# EAGLE design SPosition (EAGLE 9.3.0)
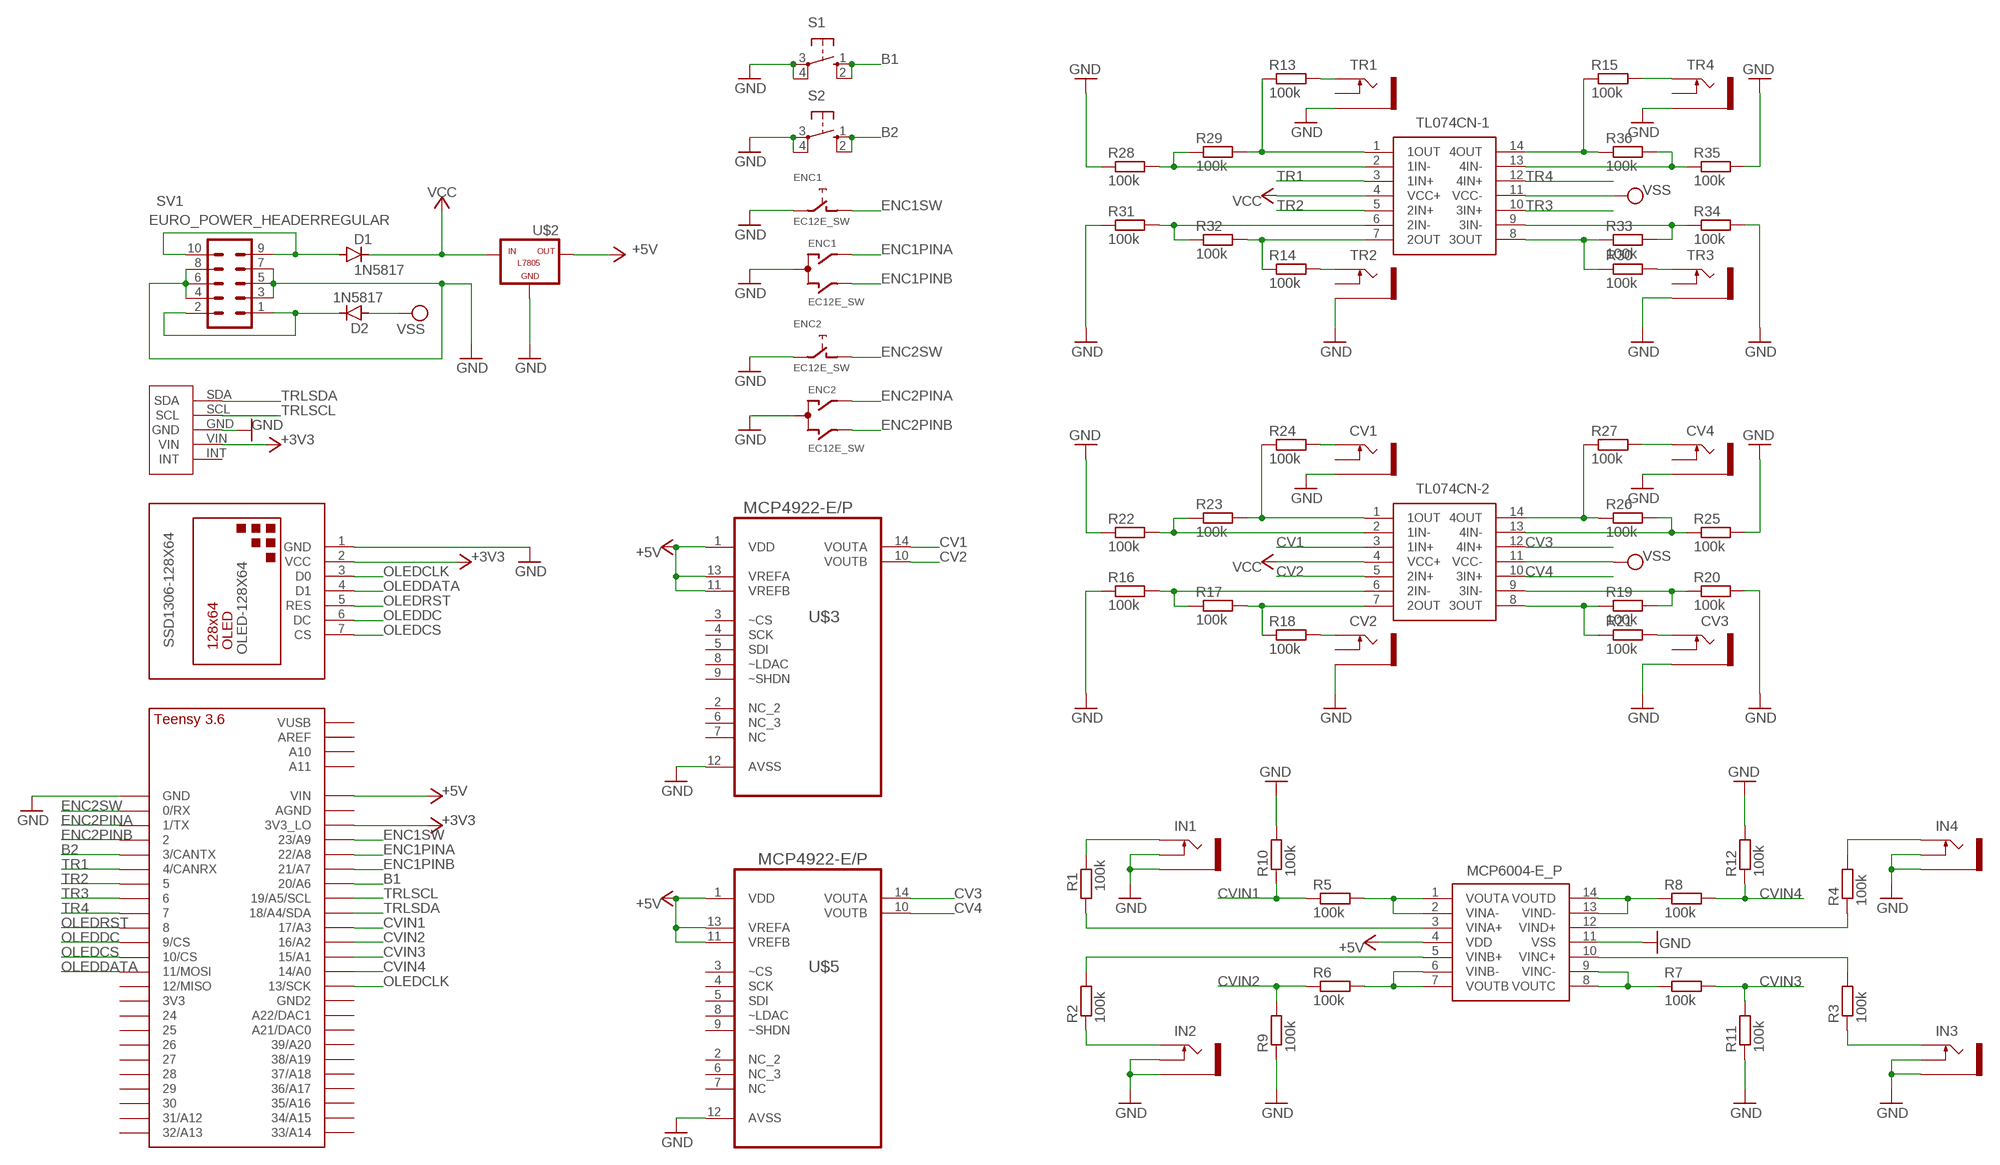
[diagram p0: schematic, sheet 1]

## Parts
CV1  THONKICONNNEW  [WQP-PJ301M-12_JACK]
CV2  THONKICONNNEW  [WQP-PJ301M-12_JACK]
CV3  THONKICONNNEW  [WQP-PJ301M-12_JACK]
CV4  THONKICONNNEW  [WQP-PJ301M-12_JACK]
D1  1N5817  1N4004  [DO41-10]
D2  1N5817  1N4004  [DO41-10]
ENC1  EC12E_SW  [ALPS_EC12E_SW]
ENC2  EC12E_SW  [ALPS_EC12E_SW]
IN1  THONKICONNNEW  [WQP-PJ301M-12_JACK]
IN2  THONKICONNNEW  [WQP-PJ301M-12_JACK]
IN3  THONKICONNNEW  [WQP-PJ301M-12_JACK]
IN4  THONKICONNNEW  [WQP-PJ301M-12_JACK]
MCP6004-E_P  MCP6004-E_P  [DIP781W56P254L1918H533Q14N]
R1  100k  R-EU_R0805  [R0805]
R2  100k  R-EU_R0805  [R0805]
R3  100k  R-EU_R0805  [R0805]
R4  100k  R-EU_R0805  [R0805]
R5  100k  R-EU_R0805  [R0805]
R6  100k  R-EU_R0805  [R0805]
R7  100k  R-EU_R0805  [R0805]
R8  100k  R-EU_R0805  [R0805]
R9  100k  R-EU_R0805  [R0805]
R10  100k  R-EU_R0805  [R0805]
R11  100k  R-EU_R0805  [R0805]
R12  100k  R-EU_R0805  [R0805]
R13  100k  R-EU_R0805  [R0805]
R14  100k  R-EU_R0805  [R0805]
R15  100k  R-EU_R0805  [R0805]
R16  100k  R-EU_R0805  [R0805]
R17  100k  R-EU_R0805  [R0805]
R18  100k  R-EU_R0805  [R0805]
R19  100k  R-EU_R0805  [R0805]
R20  100k  R-EU_R0805  [R0805]
R21  100k  R-EU_R0805  [R0805]
R22  100k  R-EU_R0805  [R0805]
R23  100k  R-EU_R0805  [R0805]
R24  100k  R-EU_R0805  [R0805]
R25  100k  R-EU_R0805  [R0805]
R26  100k  R-EU_R0805  [R0805]
R27  100k  R-EU_R0805  [R0805]
R28  100k  R-EU_R0805  [R0805]
R29  100k  R-EU_R0805  [R0805]
R30  100k  R-EU_R0805  [R0805]
R31  100k  R-EU_R0805  [R0805]
R32  100k  R-EU_R0805  [R0805]
R33  100k  R-EU_R0805  [R0805]
R34  100k  R-EU_R0805  [R0805]
R35  100k  R-EU_R0805  [R0805]
R36  100k  R-EU_R0805  [R0805]
S1  10-XX  [B3F-10XX]
S2  10-XX  [B3F-10XX]
SSD1306-128X64  OLED-128X64  [DISPLAY-OLED-128X64-SMALL]
SV1  EURO_POWER_HEADERREGULAR  [EURO_POWER_HEADER]
TL074CN-1  TL074CN  [DIP794W53P254L1930H508Q14N]
TL074CN-2  TL074CN  [DIP794W53P254L1930H508Q14N]
TR1  THONKICONNNEW  [WQP-PJ301M-12_JACK]
TR2  THONKICONNNEW  [WQP-PJ301M-12_JACK]
TR3  THONKICONNNEW  [WQP-PJ301M-12_JACK]
TR4  THONKICONNNEW  [WQP-PJ301M-12_JACK]
U$1  TEENSY_3.5/3.6_BASIC  [TEENSY_3.5/3.6_BASIC]
U$2  -L7805  [L7805]
U$3  MCP4922-E/P  [DIP254P762X533-14]
U$4  SUPERPOSITION  [SUPERPOSITION]
U$5  MCP4922-E/P  [DIP254P762X533-14]

## Nets
+3V3: SSD1306-128X64.2(VCC) U$1.3V3_LO U$4.VIN
+5V: MCP6004-E_P.4(VDD) U$1.VIN U$2.OUT U$3.1(VDD) U$3.11(VREFB) U$3.13(VREFA) U$5.1(VDD) U$5.11(VREFB) U$5.13(VREFA)
B1: S1.1(S) S1.2(S1) U$1.20/A6
B2: S2.1(S) S2.2(S1) U$1.3/CANTX
CV1: TL074CN-2.3(1IN+) U$3.14(VOUTA)
CV2: TL074CN-2.5(2IN+) U$3.10(VOUTB)
CV3: TL074CN-2.12(4IN+) U$5.14(VOUTA)
CV4: TL074CN-2.10(3IN+) U$5.10(VOUTB)
CVIN1: R5.1 R10.1 U$1.17/A3
CVIN2: R6.1 R9.2 U$1.16/A2
CVIN3: R7.2 R11.2 U$1.15/A1
CVIN4: R8.2 R12.1 U$1.14/A0
ENC1PINA: ENC1.A U$1.22/A8
ENC1PINB: ENC1.B U$1.21/A7
ENC1SW: ENC1.D U$1.23/A9
ENC2PINA: ENC2.A U$1.1/TX
ENC2PINB: ENC2.B U$1.2
ENC2SW: ENC2.D U$1.0/RX
GND: CV1.P$3_SLEEVE(SLEEVE) CV2.P$3_SLEEVE(SLEEVE) CV3.P$3_SLEEVE(SLEEVE) CV4.P$3_SLEEVE(SLEEVE) ENC1.C ENC1.E ENC2.C ENC2.E IN1.P$2_SWITCH(SWITCH) IN1.P$3_SLEEVE(SLEEVE) IN2.P$2_SWITCH(SWITCH) IN2.P$3_SLEEVE(SLEEVE) IN3.P$2_SWITCH(SWITCH) IN3.P$3_SLEEVE(SLEEVE) IN4.P$2_SWITCH(SWITCH) IN4.P$3_SLEEVE(SLEEVE) MCP6004-E_P.11(VSS) R9.1 R10.2 R11.1 R12.2 R16.1 R20.2 R22.1 R25.2 R28.1 R31.1 R34.2 R35.2 S1.3(P) S1.4(P1) S2.3(P) S2.4(P1) SSD1306-128X64.1(GND) SV1.3 SV1.4 SV1.5 SV1.6 SV1.7 SV1.8 TR1.P$3_SLEEVE(SLEEVE) TR2.P$3_SLEEVE(SLEEVE) TR3.P$3_SLEEVE(SLEEVE) TR4.P$3_SLEEVE(SLEEVE) U$1.GND U$2.GND U$3.12(AVSS) U$4.GND U$5.12(AVSS)
N$1: D1.A SV1.9 SV1.10
N$2: R17.2 R18.1 TL074CN-2.7(2OUT)
N$3: IN1.P$1_TIP(TIP) R1.2
N$4: MCP6004-E_P.6(VINB-) MCP6004-E_P.7(VOUTB) R6.2
N$5: IN2.P$1_TIP(TIP) R2.1
N$6: IN3.P$1_TIP(TIP) R3.1
N$7: R14.1 R32.2 TL074CN-1.7(2OUT)
N$9: IN4.P$1_TIP(TIP) R4.2
N$11: MCP6004-E_P.5(VINB+) R2.2
N$12: MCP6004-E_P.13(VIND-) MCP6004-E_P.14(VOUTD) R8.1
N$13: MCP6004-E_P.8(VOUTC) MCP6004-E_P.9(VINC-) R7.1
N$14: MCP6004-E_P.3(VINA+) R1.1
N$15: MCP6004-E_P.10(VINC+) R3.2
N$16: MCP6004-E_P.12(VIND+) R4.1
N$17: R16.2 R17.1 TL074CN-2.6(2IN-)
N$18: MCP6004-E_P.1(VOUTA) MCP6004-E_P.2(VINA-) R5.2
N$19: CV2.P$1_TIP(TIP) R18.2
N$20: CV3.P$1_TIP(TIP) R21.2
N$21: R19.1 R21.1 TL074CN-2.8(3OUT)
N$22: R19.2 R20.1 TL074CN-2.9(3IN-)
N$23: R22.2 R23.1 TL074CN-2.2(1IN-)
N$24: R23.2 R24.1 TL074CN-2.1(1OUT)
N$25: CV1.P$1_TIP(TIP) R24.2
N$26: R25.1 R26.2 TL074CN-2.13(4IN-)
N$27: R26.1 R27.1 TL074CN-2.14(4OUT)
N$28: CV4.P$1_TIP(TIP) R27.2
N$29: D2.C SV1.1 SV1.2
N$30: R28.2 R29.1 TL074CN-1.2(1IN-)
N$31: R13.1 R29.2 TL074CN-1.1(1OUT)
N$32: R31.2 R32.1 TL074CN-1.6(2IN-)
N$33: R13.2 TR1.P$1_TIP(TIP)
N$34: R14.2 TR2.P$1_TIP(TIP)
N$35: R33.2 R34.1 TL074CN-1.9(3IN-)
N$36: R30.2 TR3.P$1_TIP(TIP)
N$37: R30.1 R33.1 TL074CN-1.8(3OUT)
N$38: R35.1 R36.2 TL074CN-1.13(4IN-)
N$39: R15.1 R36.1 TL074CN-1.14(4OUT)
N$40: R15.2 TR4.P$1_TIP(TIP)
OLEDCLK: SSD1306-128X64.3(D0) U$1.13/SCK
OLEDCS: SSD1306-128X64.7(CS) U$1.10/CS
OLEDDATA: SSD1306-128X64.4(D1) U$1.11/MOSI
OLEDDC: SSD1306-128X64.6(DC) U$1.9/CS
OLEDRST: SSD1306-128X64.5(RES) U$1.8
TR1: TL074CN-1.3(1IN+) U$1.4/CANRX
TR2: TL074CN-1.5(2IN+) U$1.5
TR3: TL074CN-1.10(3IN+) U$1.6
TR4: TL074CN-1.12(4IN+) U$1.7
TRLSCL: U$1.19/A5/SCL U$4.SCL
TRLSDA: U$1.18/A4/SDA U$4.SDA
VCC: D1.C TL074CN-1.4(VCC+) TL074CN-2.4(VCC+) U$2.IN
VSS: D2.A TL074CN-1.11(VCC-) TL074CN-2.11(VCC-)
Unconnected: CV1.P$2_SWITCH(SWITCH) CV2.P$2_SWITCH(SWITCH) CV3.P$2_SWITCH(SWITCH) CV4.P$2_SWITCH(SWITCH) ENC1.GND1(G) ENC1.GND2(G) ENC2.GND1(G) ENC2.GND2(G) TR1.P$2_SWITCH(SWITCH) TR2.P$2_SWITCH(SWITCH) TR3.P$2_SWITCH(SWITCH) TR4.P$2_SWITCH(SWITCH) U$1.3V3 U$1.12/MISO U$1.21/DAC0(A21/DAC0) U$1.24 U$1.25 U$1.26 U$1.27 U$1.28 U$1.29 U$1.30 U$1.31/A12 U$1.32/A13 U$1.33/A14 U$1.34/A15 U$1.35/A16 U$1.36/A17 U$1.37/A18 U$1.38/A19 U$1.39/A20 U$1.A10 U$1.A11 U$1.A22/DAC1 U$1.AGND U$1.AREF U$1.GND2 U$1.VUSB U$3.2(NC_2) U$3.3(~CS) U$3.4(SCK) U$3.5(SDI) U$3.6(NC_3) U$3.7(NC) U$3.8(~LDAC) U$3.9(~SHDN) U$4.INT U$5.2(NC_2) U$5.3(~CS) U$5.4(SCK) U$5.5(SDI) U$5.6(NC_3) U$5.7(NC) U$5.8(~LDAC) U$5.9(~SHDN)

## Library data of the parts
CV1-CV4 IN1-IN4 TR1-TR4 = MusicThingModular:THONKICONN: 3.5mm socket for Eurorack modular synths
D1 D2 = diode:1N4004: DIODE general purpose rectifier, 1 A
ENC1 ENC2 = switch-alps:EC12E_SW: ALPS rotary Encoder EC12E series with switch; MPN: EC12E2424407; OC_FARNELL: 1520813; OC_NEWARK: 74M1068
MCP6004-E_P = mcp6004-e_p:MCP6004-E_P: Microchip MCP6004-E/P Op Amp, 1MHz, 1.8 6 V Rail-Rail 0.6V/s Linear, 14-pin PDIP Source: Datasheet <http://docs-asia.electrocomponents.com/webdocs/1381/0900766b81381145.pdf>; DESCRIPTION: Microchip MCP6004-E/P Op Amp, 1MHz, 1.8 6 V Rail-Rail 0.6V/s Linear, 14-pin PDIP; HEIGHT: 5.334mm; MANUFACTURER_NAME: Microchip; MANUFACTURER_PART_NUMBER: mcp6004-e/p; MOUSER_PART_NUMBER: 579-MCP6004-E/P; MOUSER_PRICE-STOCK: https://www.mouser.com/Search/Refine.aspx?Keyword=579-MCP6004-E%2FP; RS_PART_NUMBER: 7386178P; RS_PRICE-STOCK: http://uk.rs-online.com/web/p/products/7386178P
R1-R36 = Clean-Kong:R-EU_: RESISTOR, European symbol
S1 S2 = switch-omron:10-XX: OMRON SWITCH; MPN: B3F-1000; OC_FARNELL: 176432; OC_NEWARK: 36M3542
SSD1306-128X64 = diy-modules:OLED-128X64
SV1 = MusicThingModular:EURO_POWER_HEADER: Power Header 10 pin power header for Eurorack Power Supplies Variants with fatter pads for easier soldering, and the LOCK variant which has 5mil offset pins to hold the component in place before soldering
TL074CN-1 TL074CN-2 = TL074CN:TL074CN: Quad Low-Noise JFET-Input General-Purpose Operational Amplifier Source: Datasheet <http://uk.rs-online.com/web/p/products/0302621>; DESCRIPTION: Quad Low-Noise JFET-Input General-Purpose Operational Amplifier; HEIGHT: 5.08mm; MANUFACTURER_NAME: Texas Instruments; MANUFACTURER_PART_NUMBER: TL074CN; MOUSER_PART_NUMBER: 595-TL074CN; MOUSER_PRICE-STOCK: https://www.mouser.com/Search/Refine.aspx?Keyword=595-TL074CN; RS_PART_NUMBER: 0302621P; RS_PRICE-STOCK: http://uk.rs-online.com/web/p/products/0302621P
U$1 = Teensy356:TEENSY_3.5/3.6_BASIC; OC_FARNELL: unknown
U$2 = tango:-L7805
U$3 U$5 = MCP4922-E_P:MCP4922-E/P: 12-Bit DAC; AVAILABILITY: Unavailable; DESCRIPTION: MCP4922 Series 2 Ch 12-Bit Voltage Output Digital-to-Analog Converter-PDIP-14; MF: Microchip; MP: MCP4922-E/P; PACKAGE: DIP-14 Microchip; PRICE: None
U$4 = Adafruit Trellis:SUPERPOSITION

## Net classes
1 power: width 0.406 mm

## Board
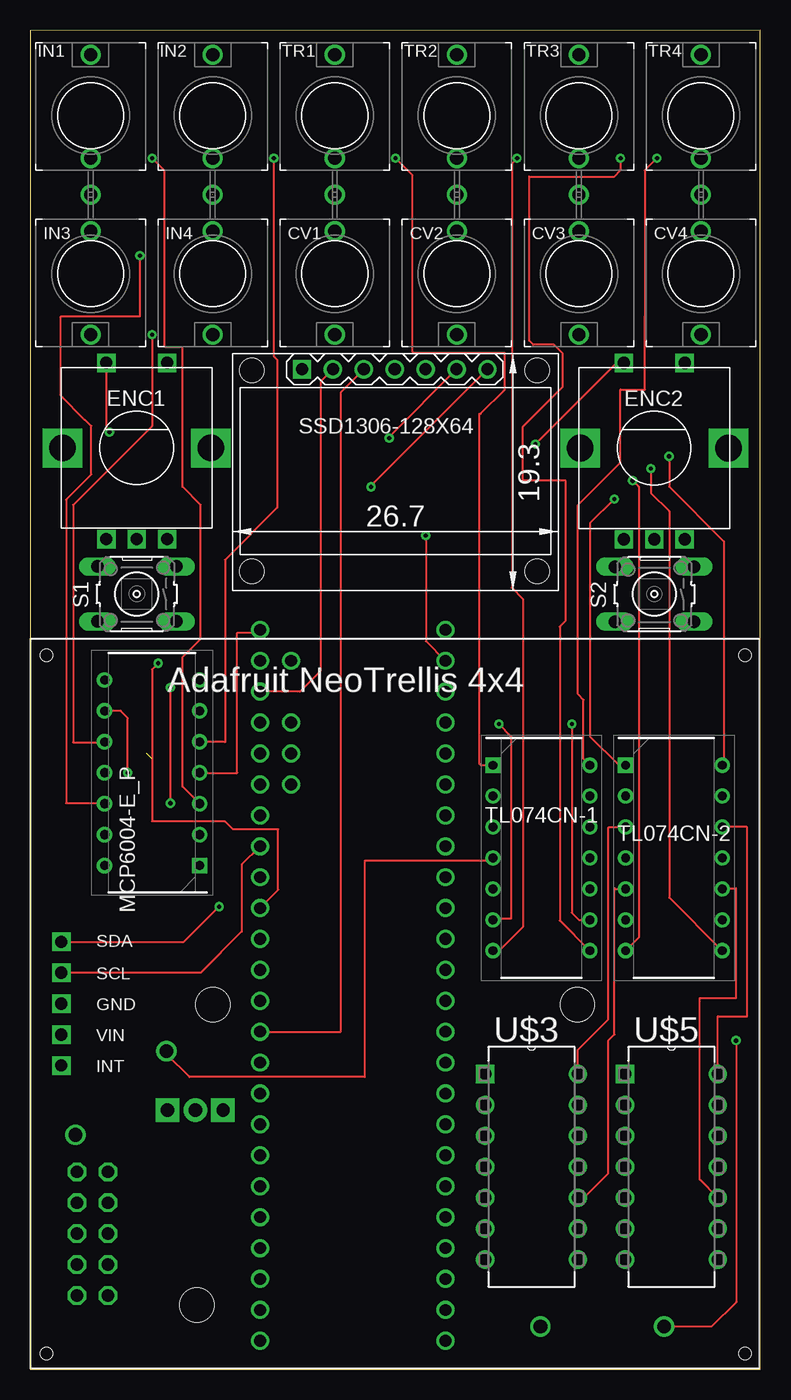
[diagram p1: board, top side]
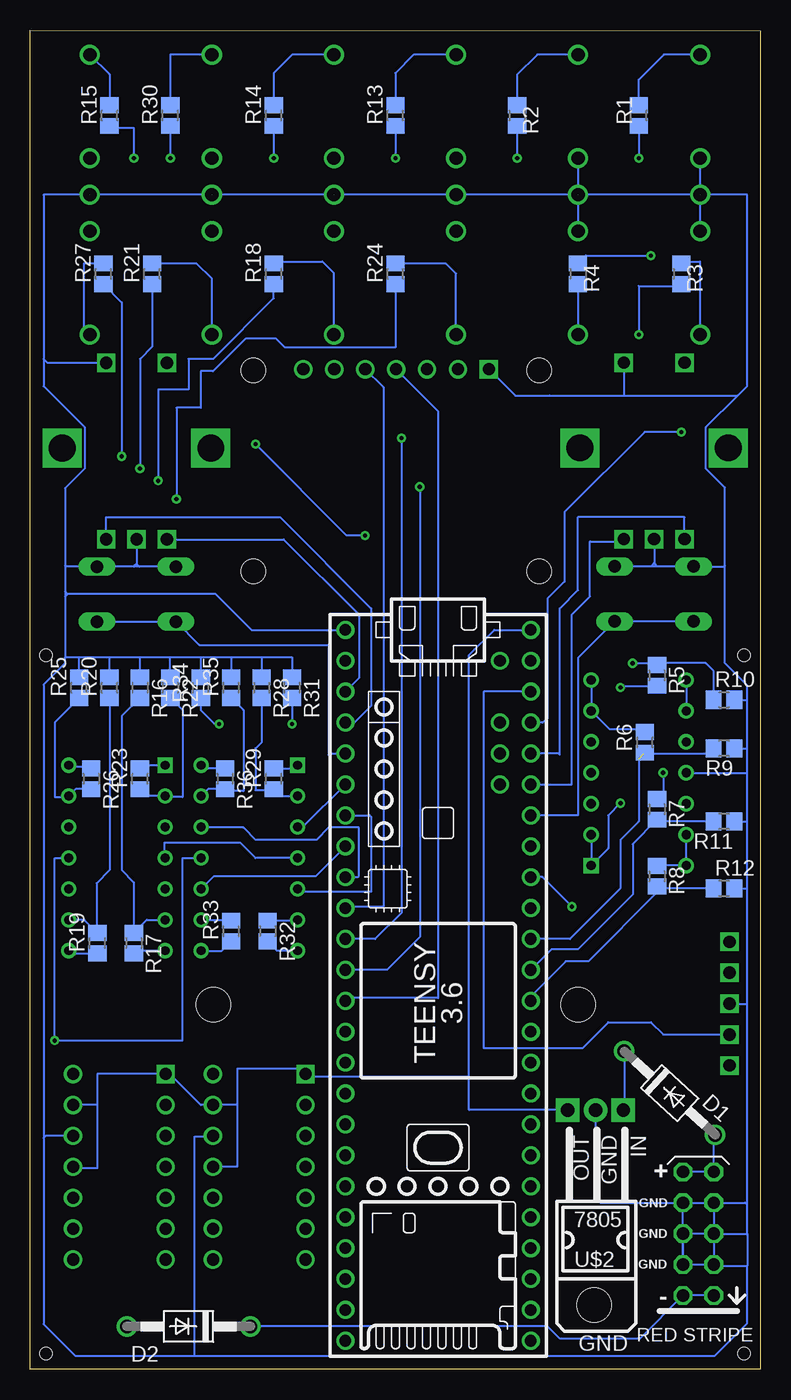
[diagram p2: board, bottom side, seen from below]

Size 60 x 110 mm. Coordinates in mm from the lower left corner, seen from the top.
Outline: 0,0 60,0 60,110 0,109.98 0,0
Copper layers (1*16): Top 0.035mm / dielectric 1.5mm / Bottom 0.035mm
Design rules "default": minimum track width 6mil, minimum drill 0.35mm, track to track 6mil, track to pad 6mil, pad to pad 6mil, via to via 6mil, smd to smd 6mil, copper to edge 40mil, drill to drill 6mil, minimum pad ring 10mil, minimum via ring 8mil, stop-mask expansion 4mil, vias tented up to drill 0mil, thermal gap 10mil

### Footprints (pad centres in the part's own frame; a part is rotated, then mirrored left to right if it is on the bottom)
WQP-PJ301M-12_JACK = drill 1.1: P$1_TIP 0,5; P$2_SWITCH 0,-3.5; P$3_SLEEVE 0,-6.5
DO41-10 = drill 1.118: A 5.08,0; C -5.08,0
ALPS_EC12E_SW = drill 1 square: A -2.5,-7.5; B 2.5,-7.5; C 0,-7.5; D -2.5,7; E 2.5,7 | drill 2.2 square: GND1 -6.1,0; GND2 6.1,0
DIP781W56P254L1918H533Q14N = drill 0.759 pad 1.159 square: 1 -3.905,7.62 | drill 0.759 pad 1.159: 2 -3.905,5.08; 3 -3.905,2.54; 4 -3.905,0; 5 -3.905,-2.54; 6 -3.905,-5.08; 7 -3.905,-7.62; 8 3.905,-7.62; 9 3.905,-5.08; 10 3.905,-2.54; 11 3.905,0; 12 3.905,2.54; 13 3.905,5.08; 14 3.905,7.62
R0805 = smd 1.3 x 1.5: 1 -0.85,0; 2 0.85,0
B3F-10XX = drill 1.016 long: 1 -3.251,2.261; 2 3.251,2.261; 3 -3.251,-2.261; 4 3.251,-2.261
DISPLAY-OLED-128X64-SMALL = drill 1 square: 1 -6.985,7.62 | drill 1: 2 -4.445,7.62; 3 -1.905,7.62; 4 0.635,7.62; 5 3.175,7.62; 6 5.715,7.62; 7 8.255,7.62 | hole 2: -11.125,7.54; 12.351,7.54; 12.351,-8.97; -11.125,-8.97
EURO_POWER_HEADER = drill 1.016 octagon: 1 -5.08,-1.27; 2 -5.08,1.27; 3 -2.54,-1.27; 4 -2.54,1.27; 5 0,-1.27; 6 0,1.27; 7 2.54,-1.27; 8 2.54,1.27; 9 5.08,-1.27; 10 5.08,1.27
DIP794W53P254L1930H508Q14N = drill 0.73 pad 1.13 square: 1 -3.97,7.62 | drill 0.73 pad 1.13: 2 -3.97,5.08; 3 -3.97,2.54; 4 -3.97,0; 5 -3.97,-2.54; 6 -3.97,-5.08; 7 -3.97,-7.62; 8 3.97,-7.62; 9 3.97,-5.08; 10 3.97,-2.54; 11 3.97,0; 12 3.97,2.54; 13 3.97,5.08; 14 3.97,7.62
TEENSY_3.5/3.6_BASIC = drill 0.965: 0/RX -25.4,-7.62; 1/TX -22.86,-7.62; 2 -20.32,-7.62; 3/CANTX -17.78,-7.62; 3V3 7.62,-7.62; 3V3_LO -22.86,7.62; 4/CANRX -15.24,-7.62; 5 -12.7,-7.62; 6 -10.16,-7.62; 7 -7.62,-7.62; 8 -5.08,-7.62; 9/CS -2.54,-7.62; 10/CS 0,-7.62; 11/MOSI 2.54,-7.62; 12/MISO 5.08,-7.62; 13/SCK 5.08,7.62; 14/A0 2.54,7.62; 15/A1 0,7.62; 16/A2 -2.54,7.62; 17/A3 -5.08,7.62; 18/A4/SDA -7.62,7.62; 19/A5/SCL -10.16,7.62; 20/A6 -12.7,7.62; 21/A7 -15.24,7.62; 21/DAC0 12.7,7.62; 22/A8 -17.78,7.62; 23/A9 -20.32,7.62; 24 10.16,-7.62; 25 12.7,-7.62; 26 15.24,-7.62; 27 17.78,-7.62; 28 20.32,-7.62; 29 22.86,-7.62; 30 25.4,-7.62; 31/A12 27.94,-7.62; 32/A13 30.48,-7.62; 33/A14 30.48,7.62; 34/A15 27.94,7.62; 35/A16 25.4,7.62; 36/A17 22.86,7.62; 37/A18 20.32,7.62; 38/A19 17.78,7.62; 39/A20 15.24,7.62; A10 -17.78,5.08; A11 -15.24,5.08; A22/DAC1 10.16,7.62; AGND -25.4,7.62; AREF -20.32,5.08; GND -27.94,-7.62; GND2 7.62,7.62; VIN -27.94,7.62; VUSB -25.4,5.08
L7805 = drill 1.1 pad 1.93: GND 0.127,-9.652 | drill 1.1 pad 1.93 square: IN -2.159,-9.652; OUT 2.413,-9.652 | hole 2.8: 0.254,6.35
DIP254P762X533-14 = drill 0.991 square: 1 -7.62,15.24 | drill 0.991: 2 -7.62,12.7; 3 -7.62,10.16; 4 -7.62,7.62; 5 -7.62,5.08; 6 -7.62,2.54; 7 -7.62,0; 8 0,0; 9 0,2.54; 10 0,5.08; 11 0,7.62; 12 0,10.16; 13 0,12.7; 14 0,15.24
SUPERPOSITION = drill 1 square: GND 2.54,-29.972; INT 2.54,-35.052; SCL 2.54,-27.432; SDA 2.54,-24.892; VIN 2.54,-32.512 | hole 1: 1.335,-1.335; 58.736,-1.335; 1.335,-58.736; 58.736,-58.736 | hole 2.8: 14.989,-30.049; 44.962,-30.049

### Placement (x,y rotation side)
CV1  25.02,90 180 top
CV2  35.05,90 180 top
CV3  45.09,90 180 top
CV4  55.12,90 180 top
D1  7.45,22.68 317.4 bottom
D2  47,3.5 180 bottom
ENC1  8.73,75.69 0 top
ENC2  51.28,75.68 0 top
IN1  4.95,103 0 top
IN2  14.99,103 0 top
IN3  4.95,90 180 top
IN4  14.99,90 180 top
MCP6004-E_P  10,49 180 top
R1  10,103 90 bottom
R2  20,103 270 bottom
R3  6.5,90 270 bottom
R4  15,90 270 bottom
R5  8.5,57 270 bottom
R6  9.5,51.5 90 bottom
R7  8.5,46 270 bottom
R8  8.5,40.5 270 bottom
R9  3,51 180 bottom
R10  3,55 0 bottom
R11  3,45 180 bottom
R12  3,39.5 0 bottom
R13  30,103 90 bottom
R14  40,103 90 bottom
R15  53.5,103 90 bottom
R16  51,56 270 bottom
R17  51.5,35 270 bottom
R18  40,90 90 bottom
R19  54.5,35 90 bottom
R20  53.5,56 90 bottom
R21  50,90 90 bottom
R22  48.5,56 270 bottom
R23  51,48.5 90 bottom
R24  30,90 90 bottom
R25  56,56 90 bottom
R26  55,48.5 270 bottom
R27  54,90 90 bottom
R28  41,56 270 bottom
R29  40,48.5 90 bottom
R30  48.5,103 90 bottom
R31  38.5,56 270 bottom
R32  40.5,36 270 bottom
R33  43.5,36 90 bottom
R34  46,56 90 bottom
R35  43.5,56 90 bottom
R36  44,48.5 270 bottom
S1  8.74,63.7 180 top
S2  51.29,63.68 180 top
SSD1306-128X64  29.31,74.54 0 top
SV1  5.1,11.12 90 bottom
TL074CN-1  42,42 0 top
TL074CN-2  52.89,42 0 top
TR1  25.02,103 0 top
TR2  35.05,103 0 top
TR3  45.09,103 0 top
TR4  55.12,103 0 top
U$1  26.5,32.8 270 bottom
U$2  13.43,11.62 180 bottom
U$3  45,9 0 top
U$4  0,60 0 top
U$5  56.5,9 0 top

### Tracks (layer width: path | path; a pad name or v marks a point on that pad's centre or on a via)
+3V3
  Top 0.152: SSD1306-128X64.2 23.86,81.16 23.86,57.37 22.16,55.66 U$1.3V3_LO
  Bottom 0.152: U$1.3V3_LO 22.73,55.66 22.73,26.39 14.61,26.39 12.5,28.5 9,28.5 7.99,27.49 U$4.VIN
+5V
  Top 0.152: MCP6004-E_P.4 17,49 17,60.5 18.64,60.5 U$1.VIN
  Bottom 0.152: U$2.OUT 15.85,21.29 23.95,21.29 23.95,24 | U$1.VIN 21.88,60.74 23.95,58.67 23.95,24 | 23.95,24 37.14,24 U$3.1 37.84,24.7 43,24.7 43,21.7 | 43,21.7 U$3.13 46,21.7 48.54,24.24 U$5.1 54.5,24.24 54.5,21.7 | 43,21.7 43,16.62 U$3.11 | 54.5,21.7 U$5.13 | 54.5,21.7 54.5,16.5 56.38,16.5 U$5.11
B1
  Bottom 0.152: S1.2 S1.1 15,58.43 15,45.5 U$1.20/A6
B2
  Bottom 0.152: S2.1 S2.2 46.12,59.5 35.5,59.5 35.5,50.5 35.42,50.58 U$1.3/CANTX
CV1
  Top 0.152: U$3.14 45,26.24 47.5,28.74 47.5,44.5 47.54,44.54 TL074CN-2.3
CV2
  Top 0.152: U$3.10 45.5,14.08 47.5,16.08 47.5,27 48,27.5 48,39.5 48.04,39.46 TL074CN-2.5
CV3
  Top 0.152: U$5.14 56.5,29 58.91,29 58.91,44.5 58.87,44.54 TL074CN-2.12
CV4
  Top 0.152: U$5.10 55,15.58 55,30.5 58,30.5 58,39.5 57.96,39.46 TL074CN-2.10
CVIN1  (via drill 0.35)
  Top 0.152: U$1.17/A3 20.38,39.38 20.38,44.35 16.65,44.35 16,45 10,45 10,57.5 v10.5,58
  Bottom 0.152: R10.1 3.85,57.35 4.5,58 8.5,58 R5.1 8.65,58 v10.5,58
CVIN2  (1 unrouted)
  Bottom 0.152: R9.2 4.27,50.58 9.57,50.58 R6.1 | 10,50.15 10,45 11.5,43.5 11.5,39.5 15.66,35.34 U$1.16/A2
CVIN3
  Bottom 0.152: R11.2 8.35,45 R7.2 10.5,43.15 10.5,39 15,34.5 17.18,34.5 U$1.15/A1
CVIN4
  Bottom 0.152: R12.1 8.35,39.5 R8.2 8.5,39.15 14.15,33.5 16,33.5 18.88,30.62 U$1.14/A0
ENC1PINA
  Bottom 0.152: ENC1.A 6.24,70 15,70 15,64 16.5,62.5 16.5,50.5 16.58,50.58 U$1.22/A8
ENC1PINB
  Bottom 0.152: U$1.21/A7 15.5,48.04 15.5,62 14,63.5 14,68 11.43,68 ENC1.B
ENC1SW  (via drill 0.35)
  Top 0.152: v6.5,77 6.24,77.27 ENC1.D
  Bottom 0.152: v6.5,77 9.5,77 16.09,70.41 16.09,64.7 17.5,63.3 17.5,53.5 17.88,53.12 U$1.23/A9
ENC2PINA
  Bottom 0.152: ENC2.A 39.18,68.18 33,62 33,56.78 U$1.1/TX
ENC2PINB
  Bottom 0.152: ENC2.B 53.78,70 39.5,70 32,62.5 32,54.5 33.38,53.12 U$1.2
ENC2SW  (via drill 0.35)
  Top 0.152: v32.5,68.5 32.5,59.82 U$1.0/RX | ENC2.D 48.18,82.68 v41.5,76
  Bottom 0.152: v41.5,76 34,68.5 v32.5,68.5
GND  (5 unrouted)
  Bottom 0.152: 1.09,11.12 SV1.5 6.25,11.12 6.37,11 | 1.09,11.12 1.09,13.5 | 1.09,13.5 1.09,30 | 1.09,30 1.09,39.5 | 1.09,39.5 1.09,45 | 1.09,45 1.09,49 | 1.09,49 1.09,51 | 1.09,51 1.09,55 | 1.09,55 1.09,56.17 2.93,58.01 2.93,66 | 1.87,80 4.47,77.39 4.47,73.99 2.93,72.44 2.93,66 | 1.87,80 1.09,80.77 1.09,96.5 IN1.P$3_SLEEVE | TR2.P$3_SLEEVE | TR2.P$3_SLEEVE TR3.P$3_SLEEVE | TR3.P$3_SLEEVE TR4.P$3_SLEEVE | TR4.P$3_SLEEVE 58.91,96.5 58.91,83 | 58.91,83 58.91,80.75 55.54,77.39 55.54,73.98 57.14,72.38 57.14,66 | 57.14,66 57.14,63.9 | 57.14,63.9 57.14,63.5 | 57.14,63.5 57.14,58.5 | 58.91,19 58.91,56.24 57.14,58.01 57.14,58.5 | 58.91,19 58.91,3.69 56.31,1.09 46.5,1.09 | 1.09,8.5 1.09,3.76 3.76,1.09 46.5,1.09 | 3.5,8.5 3.75,8.5 SV1.3 SV1.4 | 3.5,8.5 1.09,8.5 | SV1.4 6.37,11 | 6.37,11 SV1.8 | SV1.8 SV1.7 | SV1.7 3.83,8.83 3.5,8.5 | 1.12,30.03 1.09,30 | 1.09,11.12 1.09,8.5 | SV1.7 1.26,13.66 1.09,13.5 | R10.2 1.09,55 | R9.1 1.09,51 | R11.1 1.09,45 | R12.2 1.09,39.5 | U$4.GND 2.51,30 1.09,30 | U$2.GND 13.55,14.05 13.16,13.66 SV1.8 | MCP6004-E_P.11 1.09,49 | 8.5,65.96 S1.4 2.97,65.96 2.93,66 | 8.5,65.96 9,65.96 | 9,65.96 S1.3 | ENC1.C 8.73,66.19 | 8.73,66.19 8.5,65.96 | 8.73,66.19 8.77,66.19 9,65.96 | 51.06,65.94 S2.4 47.04,65.94 | 51.06,65.94 51.5,65.94 | 51.5,65.94 S2.3 57.08,65.94 57.14,66 | ENC2.C 51.28,66.16 | 51.28,66.16 51.5,65.94 | 51.28,66.16 51.06,65.94 | ENC1.E 11.23,80 | 11.23,80 1.87,80 | 11.23,80 17.31,80 17.32,79.99 20.15,79.99 SSD1306-128X64.1 | U$1.GND 41.84,60.74 44.8,63.7 56.94,63.7 | IN3.P$2_SWITCH IN1.P$3_SLEEVE | IN1.P$3_SLEEVE IN1.P$2_SWITCH | IN2.P$2_SWITCH IN4.P$3_SLEEVE | IN4.P$3_SLEEVE IN4.P$2_SWITCH | ENC2.E 58.59,82.68 58.91,83 | 57.14,58.5 56,58.5
  Bottom 0.152: 56,58.5 53.5,58.5 | 51,58.5 48.5,58.5 | 53.5,58.5 51,58.5 | 48.5,58.5 46,58.5 | 46,58.5 R34.2 | R22.1 48.5,58.5 | R16.1 51,58.5 | R20.2 53.5,58.5 | R25.2 56,58.5 | 46,58.5 43.5,58.5 | 43.5,58.5 R35.2 | 43.5,58.5 41,58.5 | 41,58.5 R28.1 | 41,58.5 38.5,58.5 R31.1 | U$5.12 58.75,19.16 58.91,19 | 46.5,1.09 46.5,19.11 45.05,19.11 U$3.12 | 56.94,63.7 57.14,63.5 | 56.94,63.7 57.14,63.9 | SV1.6 SV1.4 | IN1.P$3_SLEEVE | TR4.P$3_SLEEVE | IN1.P$3_SLEEVE IN4.P$3_SLEEVE | IN4.P$3_SLEEVE | IN4.P$3_SLEEVE TR1.P$3_SLEEVE | TR1.P$3_SLEEVE TR2.P$3_SLEEVE | TR3.P$3_SLEEVE | IN4.P$3_SLEEVE | TR1.P$3_SLEEVE | IN1.P$3_SLEEVE | IN4.P$3_SLEEVE | TR1.P$3_SLEEVE | IN1.P$3_SLEEVE | TR2.P$3_SLEEVE | TR2.P$3_SLEEVE
N$1
  Bottom 0.152: SV1.10 SV1.9 3.83,19.13 D1.A
N$2  (via drill 0.35)
  Top 0.152: v49.5,73 50,72.5 50,35.46 TL074CN-2.7
  Bottom 0.152: TL074CN-2.7 51.27,34.38 R17.2 | v49.5,73 49.5,80.5 47,80.5 47,83 45,83 40,88 R18.1
N$3
  Bottom 0.152: IN1.P$1_TIP 7.95,108 10,105.96 R1.2
N$4
  Bottom 0.152: MCP6004-E_P.7 MCP6004-E_P.6 12.4,52.58 9.73,52.58 R6.2
N$5
  Bottom 0.152: IN2.P$1_TIP 18.34,108 20,106.35 R2.1
N$6
  Bottom 0.152: IN3.P$1_TIP 4.95,91.01 6.34,91.01 R3.1
N$7  (via drill 0.35)
  Top 0.152: TL074CN-1.7 38.53,34.38 40.5,36.35 40.5,63.27 39.57,64.2 39.57,99.07 v40,99.5
  Bottom 0.152: TL074CN-1.7 39.73,34.38 R32.2 | R14.1 v40,99.5
N$9
  Bottom 0.152: R4.2 14.99,89.14 IN4.P$1_TIP
N$11  (via drill 0.35)
  Top 0.152: v20,99.5 20,83.22 20.28,82.95 20.28,70.78 16,66.5 16,51.5 15.96,51.54 MCP6004-E_P.5
  Bottom 0.152: R2.2 v20,99.5
N$12
  Bottom 0.152: MCP6004-E_P.13 MCP6004-E_P.14 8.47,41.38 R8.1
N$13  (via drill 0.35)
  Top 0.152: v8,49 8,53.5 7.42,54.08 MCP6004-E_P.9
  Bottom 0.152: MCP6004-E_P.8 MCP6004-E_P.9 | R7.1 8,47.35 v8,49
N$14  (via drill 0.35)
  Top 0.152: v10,99.5 11,98.5 11,84 12.5,84 12.5,72.5 14,71 14,60 12.5,58.5 12.5,47.87 MCP6004-E_P.3
  Bottom 0.152: R1.1 v10,99.5
N$15  (via drill 0.35)
  Top 0.152: v10,85 10,77.5 3.5,71 3.5,51.5 6.05,51.5 MCP6004-E_P.10
  Bottom 0.152: R3.2 6.65,89 10,89 v10,85
N$16  (via drill 0.35)
  Top 0.152: MCP6004-E_P.12 6.05,46.5 2.93,46.5 2.93,71.44 5,73.52 5,77.5 4.5,78 4.47,78 2.5,79.97 2.5,86.5 9,86.5 v9,91.5
  Bottom 0.152: R4.1 14.35,91.5 v9,91.5
N$17
  Bottom 0.152: TL074CN-2.6 50.43,36.92 R17.1 51.5,40 52.5,41 52.5,53.65 R16.2
N$18  (via drill 0.35)
  Top 0.152: v11.5,56 v11.5,46.5
  Bottom 0.152: R5.2 11.35,56.15 v11.5,56 | MCP6004-E_P.2 MCP6004-E_P.1 12.5,42.78 12.5,45.5 v11.5,46.5
N$19
  Bottom 0.152: CV2.P$1_TIP 35.05,90.05 36,91 39.85,91 R18.2
N$20
  Bottom 0.152: CV3.P$1_TIP 45.09,89.58 46.35,90.85 R21.2
N$21  (via drill 0.35)
  Top 0.152: v51,74 51,72 52.5,70.5 52.5,38.74 TL074CN-2.8
  Bottom 0.152: TL074CN-2.8 56.63,34.15 R19.1 | R21.1 50,84 51,83 v51,74
N$22
  Bottom 0.152: R19.2 54.58,35.92 | 54.58,35.92 55.57,36.92 TL074CN-2.9 | R20.1 53.5,41 54.58,39.92 54.58,35.92
N$23
  Bottom 0.152: TL074CN-2.2 49,47.08 | 49,47.08 50.43,47.08 R23.1 | R22.2 47.5,54.15 47.5,47 48.92,47 49,47.08
N$24  (via drill 0.35)
  Top 0.152: v48,71.5 46,69.5 46,52 48.38,49.62 TL074CN-2.1
  Bottom 0.152: R23.2 50.73,49.62 TL074CN-2.1 | R24.1 30,83.95 39.07,83.95 39.79,84.67 42.33,84.67 45,82 46,82 46,79 48,79 v48,71.5
N$25
  Bottom 0.152: CV1.P$1_TIP 25.02,90.02 25.85,90.85 R24.2
N$26
  Bottom 0.152: R26.2 56.29,47.65 56.72,47.22 TL074CN-2.13 56.94,47 58,47 58,53.15 R25.1
N$27  (via drill 0.35)
  Top 0.152: v52.5,75 52.5,72.5 57,68 57,49.76 TL074CN-2.14
  Bottom 0.152: TL074CN-2.14 56.74,49.5 54.85,49.5 R26.1 | R27.1 52.5,87.65 v52.5,75
N$28
  Bottom 0.152: R27.2 55.62,90.85 55.62,85.5 CV4.P$1_TIP
N$29
  Bottom 0.152: SV1.1 SV1.2 9.92,2.5 16.5,2.5 17.5,3.5 D2.C
N$30
  Bottom 0.152: R29.1 39.92,47.58 40.42,47.58 | 40.42,47.58 39.93,47.08 TL074CN-1.2 | R28.2 41,51.5 41.5,51 41.5,47.58 40.42,47.58
N$31  (via drill 0.35)
  Top 0.152: v30,99.5 31.39,98.11 31.39,83.61 31.5,83.5 39,83.5 39,80.5 37,78.5 36.89,78.5 36.89,49.76 37.03,49.62 TL074CN-1.1
  Bottom 0.152: R29.2 38.3,49.35 TL074CN-1.1 | R13.1 v30,99.5
N$32  (via drill 0.35)
  Top 0.152: v38.5,53 39.5,52 39.5,37 38.11,37 TL074CN-1.6
  Bottom 0.152: R32.1 38.1,36.85 TL074CN-1.6 | R31.2 v38.5,53
N$33
  Bottom 0.152: TR1.P$1_TIP 28.5,108 30,106.5 R13.2
N$34
  Bottom 0.152: TR2.P$1_TIP 38.49,108 40,106.5 R14.2
N$35  (via drill 0.35)
  Top 0.152: v44.5,53 44.5,37.5 45.08,36.92 TL074CN-1.9
  Bottom 0.152: R33.2 45.9,36.85 TL074CN-1.9 | R34.1 46,54.15 44.85,53 v44.5,53
N$36
  Bottom 0.152: TR3.P$1_TIP 48.49,108 48.5,108 R30.2
N$37  (via drill 0.35)
  Top 0.152: v48.5,99.5 48.5,98.5 48,98 41,98 41,84.5 41.33,84.17 43.03,84.17 43.75,83.45 43.75,80.71 40.5,77.46 40.5,73 44,73 44,61.5 43.5,61 43.5,36.85 TL074CN-1.8
  Bottom 0.152: TL074CN-1.8 44.27,34.38 R33.1 | R30.1 v48.5,99.5
N$38
  Bottom 0.152: TL074CN-1.13 45.4,47.65 R36.2 43.85,47.5 42.5,47.5 42.5,54.15 R35.1
N$39  (via drill 0.35)
  Top 0.152: v51.5,99.5 50.5,98.5 50.5,86.5 50.52,86.5 50.52,80.5 48.5,80.5 48.5,74.5 45,71 45,55.47 45.47,55 45.47,50.12 TL074CN-1.14
  Bottom 0.152: R36.1 45.7,49.35 TL074CN-1.14 | R15.1 53.35,102 51.5,102 v51.5,99.5
N$40
  Bottom 0.152: TR4.P$1_TIP 53.5,106.39 R15.2
OLEDCLK
  Top 0.152: U$1.13/SCK 25.5,27.72 25.5,80.25 SSD1306-128X64.3
OLEDCS  (via drill 0.35)
  Top 0.152: SSD1306-128X64.7 28,72.59 v28,72.5
  Bottom 0.152: v28,72.5 28,35.5 30.7,32.8 U$1.10/CS
OLEDDATA
  Bottom 0.152: SSD1306-128X64.4 26.5,78.72 26.5,30.5 33.88,30.5 U$1.11/MOSI
OLEDDC  (via drill 0.35)
  Top 0.152: SSD1306-128X64.6 29.5,76.64 v29.5,76.5
  Bottom 0.152: v29.5,76.5 29.5,37.5 31.66,35.34 U$1.9/CS
OLEDRST
  Bottom 0.152: SSD1306-128X64.5 31,80.67 31,38 34,38 U$1.8
TR1
  Bottom 0.152: U$1.4/CANRX 37.62,44.54 TL074CN-1.3
TR2
  Bottom 0.152: U$1.5 32.12,45.5 32,45.38 32,39.25 37.82,39.25 TL074CN-1.5
TR3
  Bottom 0.152: TL074CN-1.10 45.93,39.5 44.93,40.5 36.58,40.5 U$1.6
TR4
  Bottom 0.152: U$1.7 33.08,40.42 33,40.5 33,44.5 35.5,44.5 36.5,43.5 41.5,43.5 42.5,44.5 45.93,44.5 TL074CN-1.12
TRLSCL
  Top 0.152: U$1.19/A5/SCL 17.38,41.46 17.38,35.96 13.98,32.57 U$4.SCL
TRLSDA  (via drill 0.35)
  Top 0.152: U$4.SDA 12.61,35.11 v15.5,38
  Bottom 0.152: v15.5,38 17.92,40.42 U$1.18/A4/SDA
VCC
  Top 0.152: D1.C 11.19,25.88 13.07,24 27.5,24 27.5,41.77 37.8,41.77 TL074CN-1.4
  Bottom 0.152: D1.C 11.19,21.35 U$2.IN | TL074CN-1.4 41.5,42 42.74,43.24 49,43.24 49,42.08 TL074CN-2.4
VSS  (via drill 0.35)
  Top 0.152: D2.A 56,3.5 58,5.5 v58,27
  Bottom 0.152: TL074CN-1.11 47.5,42 47.5,27 v58,27 58,42 TL074CN-2.11